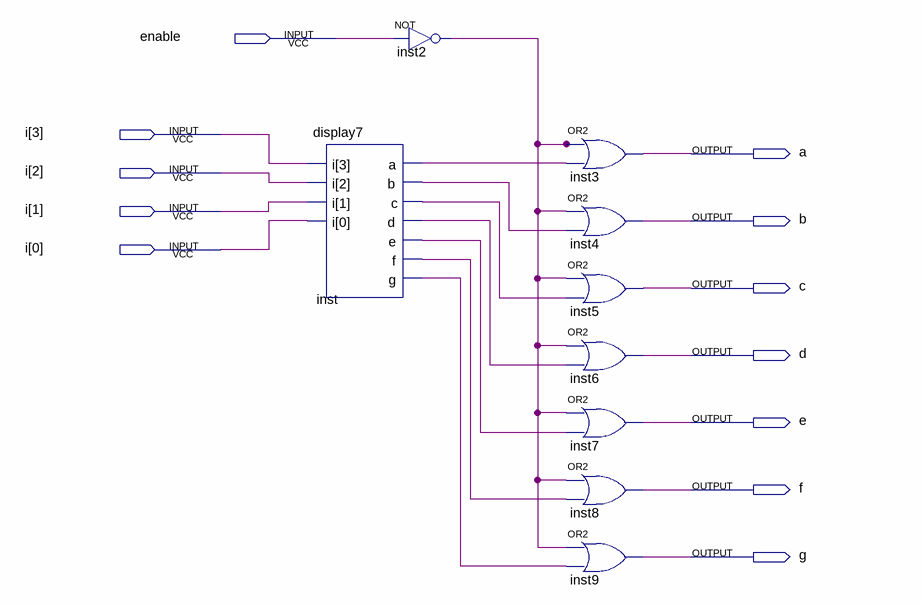
[diagram p0: schematic sheet]
// Quartus schematic display7_en (2022_05_22 18_19_10 UTC).bdf as structural Verilog: 9 symbols, 12 pins
module \display7_en_(2022_05_22_18_19_10_UTC)  (
  input  enable,
  input  [3:0] i,
  output a,
  output b,
  output c,
  output d,
  output e,
  output f,
  output g
);

  wire inst2_out, inst_a, inst_b, inst_c, inst_d, inst_e, inst_f, inst_g;

  display7 inst (.i(i), .a(inst_a), .b(inst_b), .c(inst_c), .d(inst_d), .e(inst_e), .f(inst_f), .g(inst_g));
  not inst2 (inst2_out, enable);
  or inst3 (a, inst2_out, inst_a);
  or inst4 (b, inst2_out, inst_b);
  or inst5 (c, inst2_out, inst_c);
  or inst6 (d, inst2_out, inst_d);
  or inst7 (e, inst2_out, inst_e);
  or inst8 (f, inst2_out, inst_f);
  or inst9 (g, inst2_out, inst_g);
endmodule
